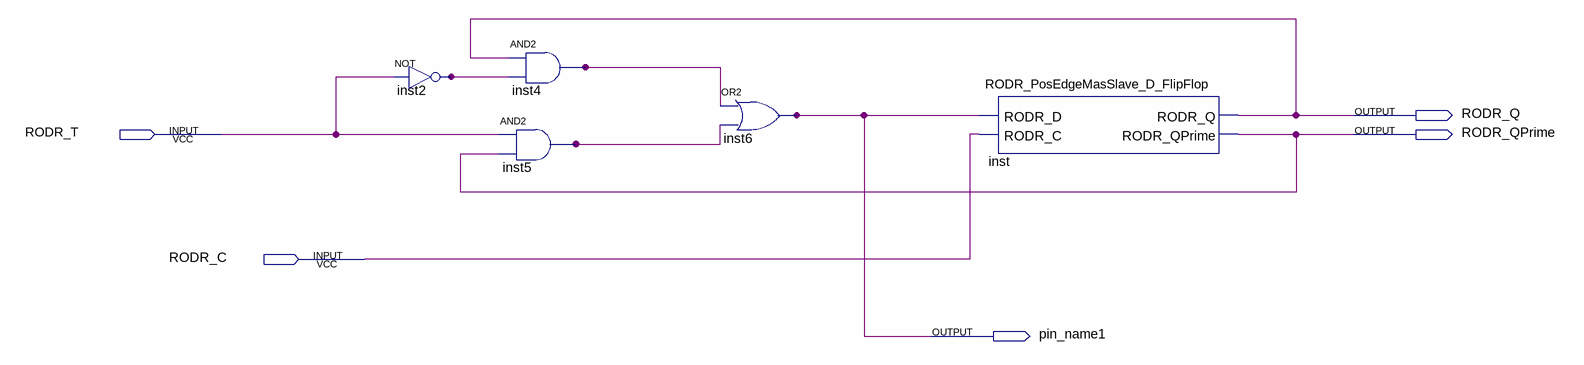
[diagram p0: schematic sheet]
// Quartus schematic RODR_TFlipFlop.bdf as structural Verilog: 5 symbols, 5 pins
module RODR_TFlipFlop (
  input  RODR_T,
  input  RODR_C,
  output RODR_Q,
  output RODR_QPrime,
  output pin_name1
);

  wire inst2_out, inst4_out, inst5_out;

  not inst2 (inst2_out, RODR_T);
  and inst4 (inst4_out, RODR_Q, inst2_out);
  and inst5 (inst5_out, RODR_T, RODR_QPrime);
  or inst6 (pin_name1, inst4_out, inst5_out);
  RODR_PosEdgeMasSlave_D_FlipFlop inst (
    .RODR_D(pin_name1), .RODR_C(RODR_C), .RODR_Q(RODR_Q), .RODR_QPrime(RODR_QPrime));
endmodule
